# Altium schematic sheet BLOCK-DIAGRAM.SchDoc: BLOCK DIAGRAM
size 420 x 297 mm; SheetNumber: 1
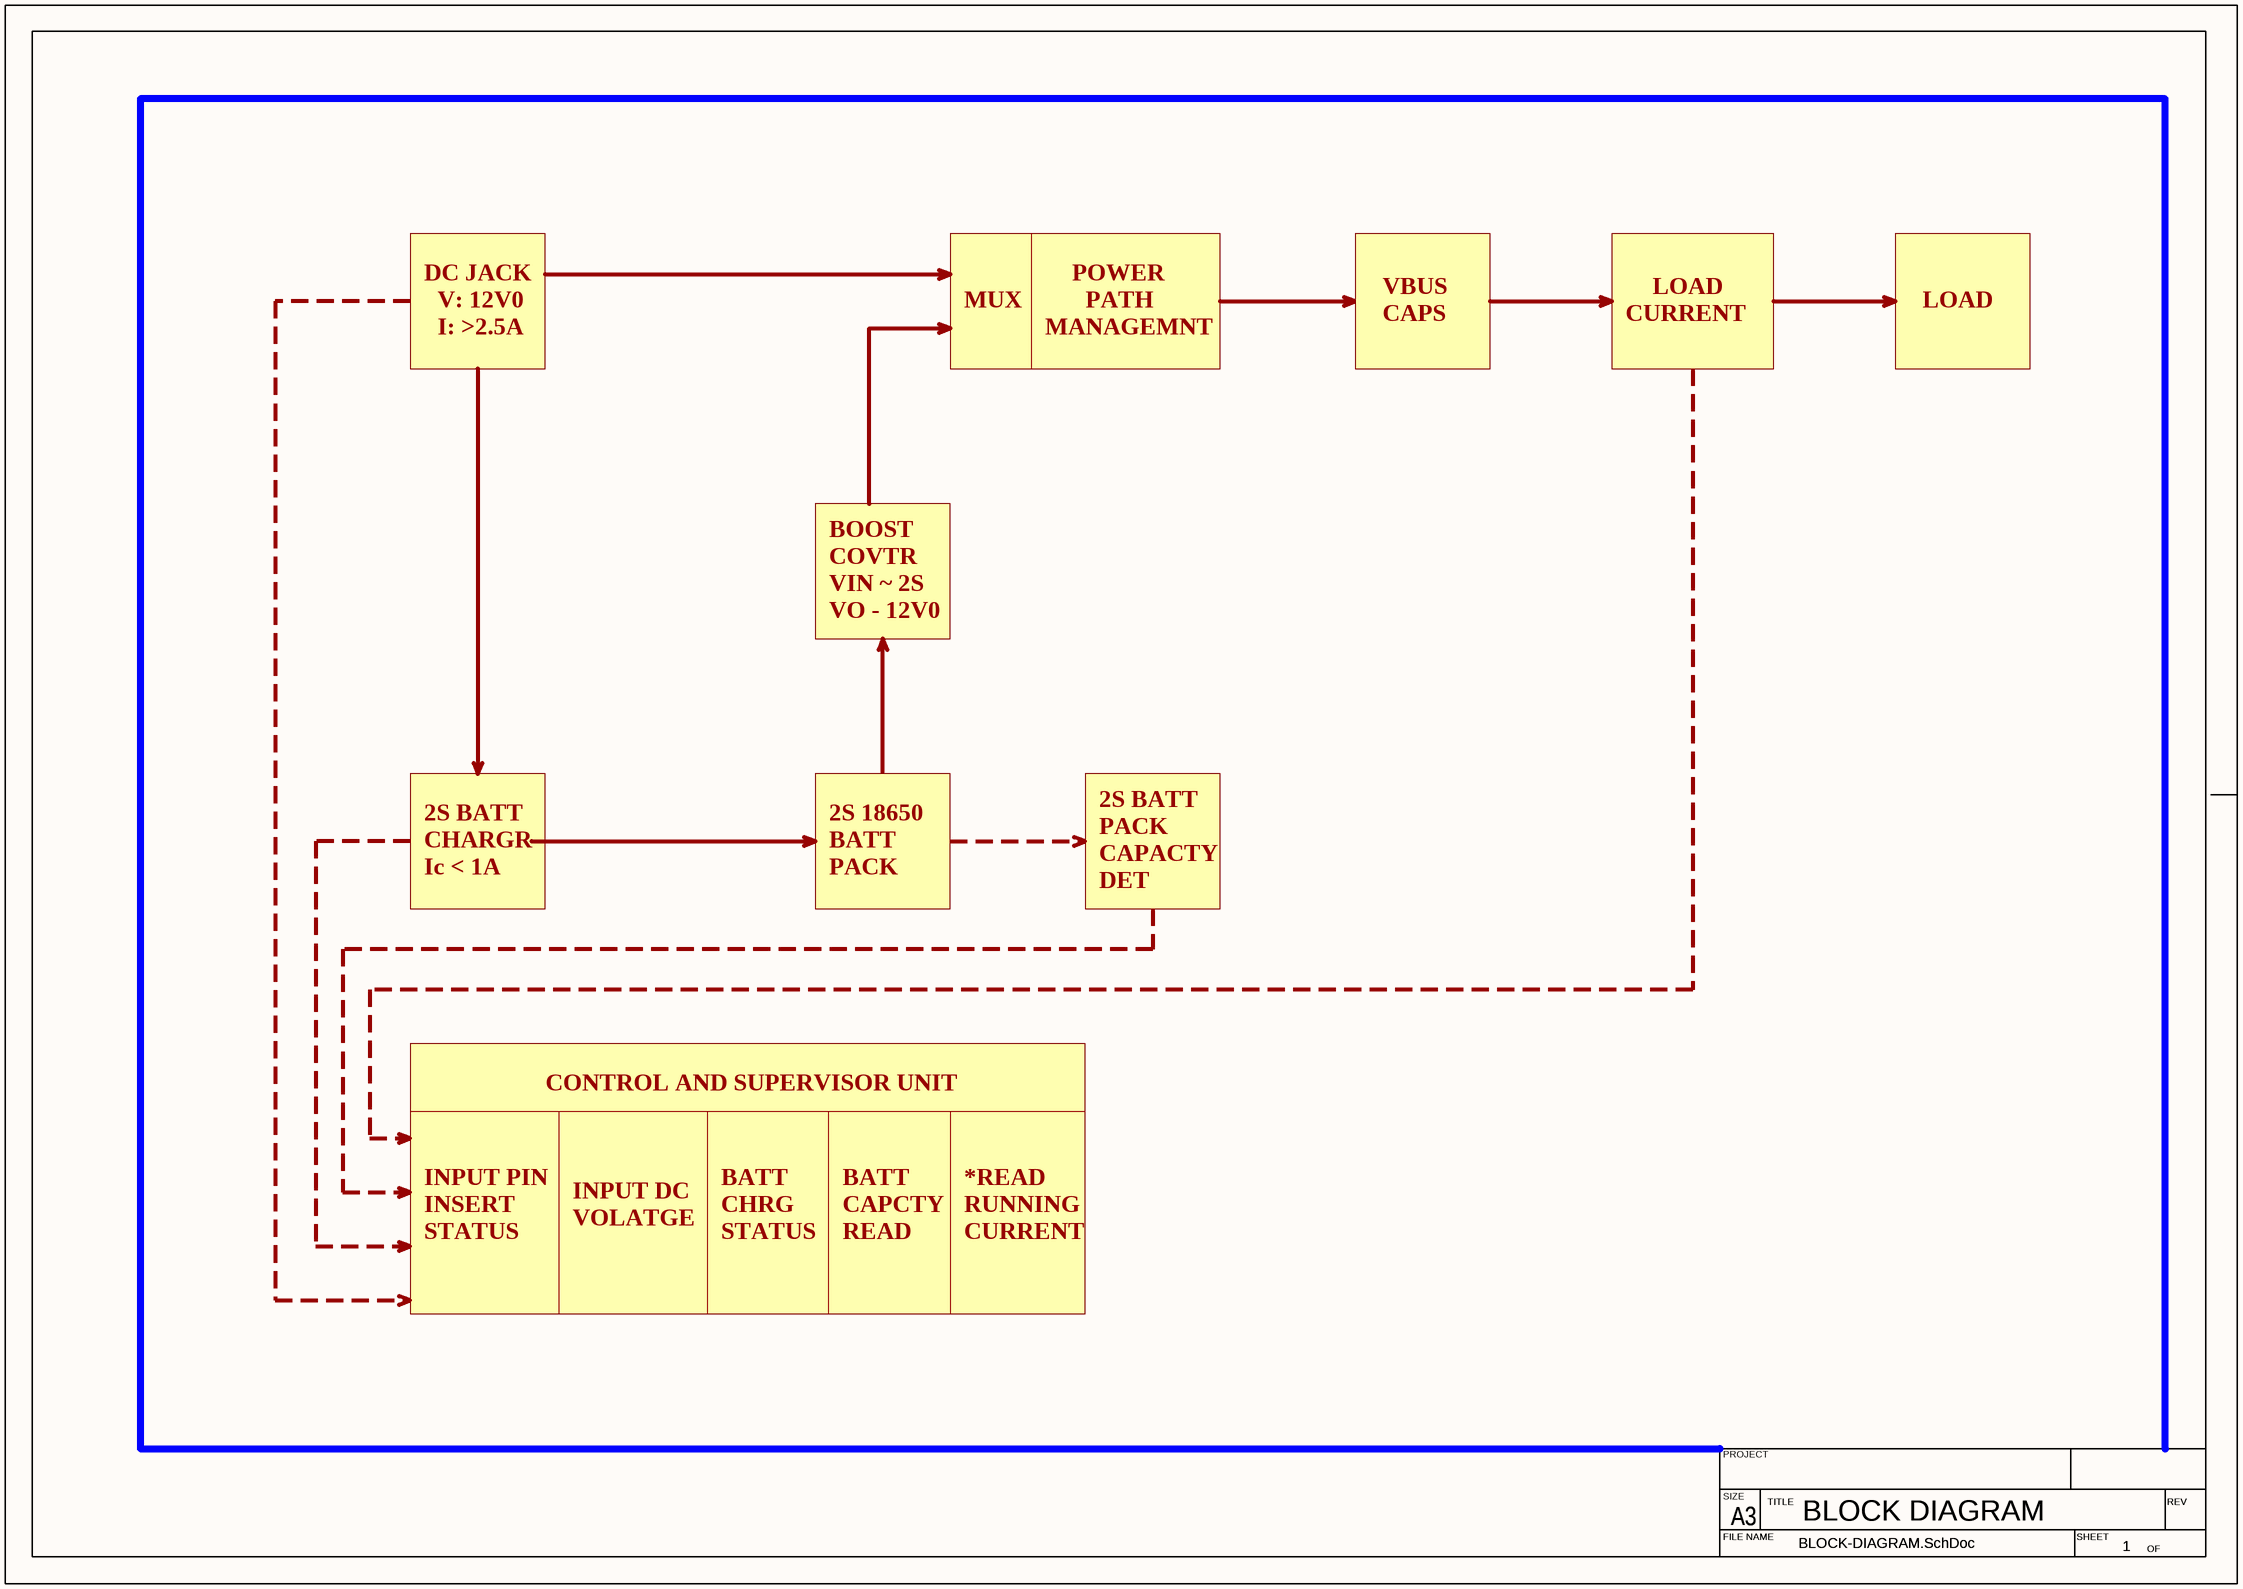
[diagram p0: BLOCK-DIAGRAM.SchDoc]

## Notes on the sheet
- DC JACK
- V: 12V0
- MUX
- POWER
- PATH
- VBUS
- CAPS
- CURRENT
- LOAD
- I: >2.5A
- MANAGEMNT
- BOOST
- COVTR
- VIN ~ 2S
- VO - 12V0
- 2S BATT
- CHARGR
- 2S 18650
- BATT
- PACK
- CAPACTY
- Ic < 1A
- DET
- CONTROL AND SUPERVISOR UNIT
- INPUT PIN
- INPUT DC
- *READ
- INSERT
- STATUS
- VOLATGE
- CHRG
- READ
- CAPCTY
- RUNNING
- PROJECT
- SIZE
- FILE NAME
- A3
- TITLE
- SHEET
- OF
- REV